# EAGLE schematic tulipv4_r11 (EAGLE 6.1)
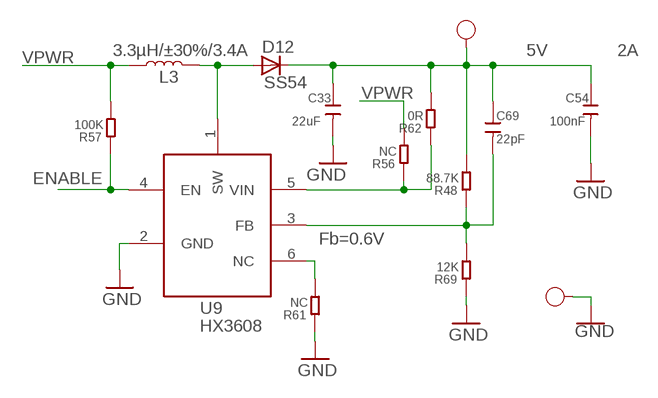
[diagram p0: schematic, sheet 1, part 1 of 2]
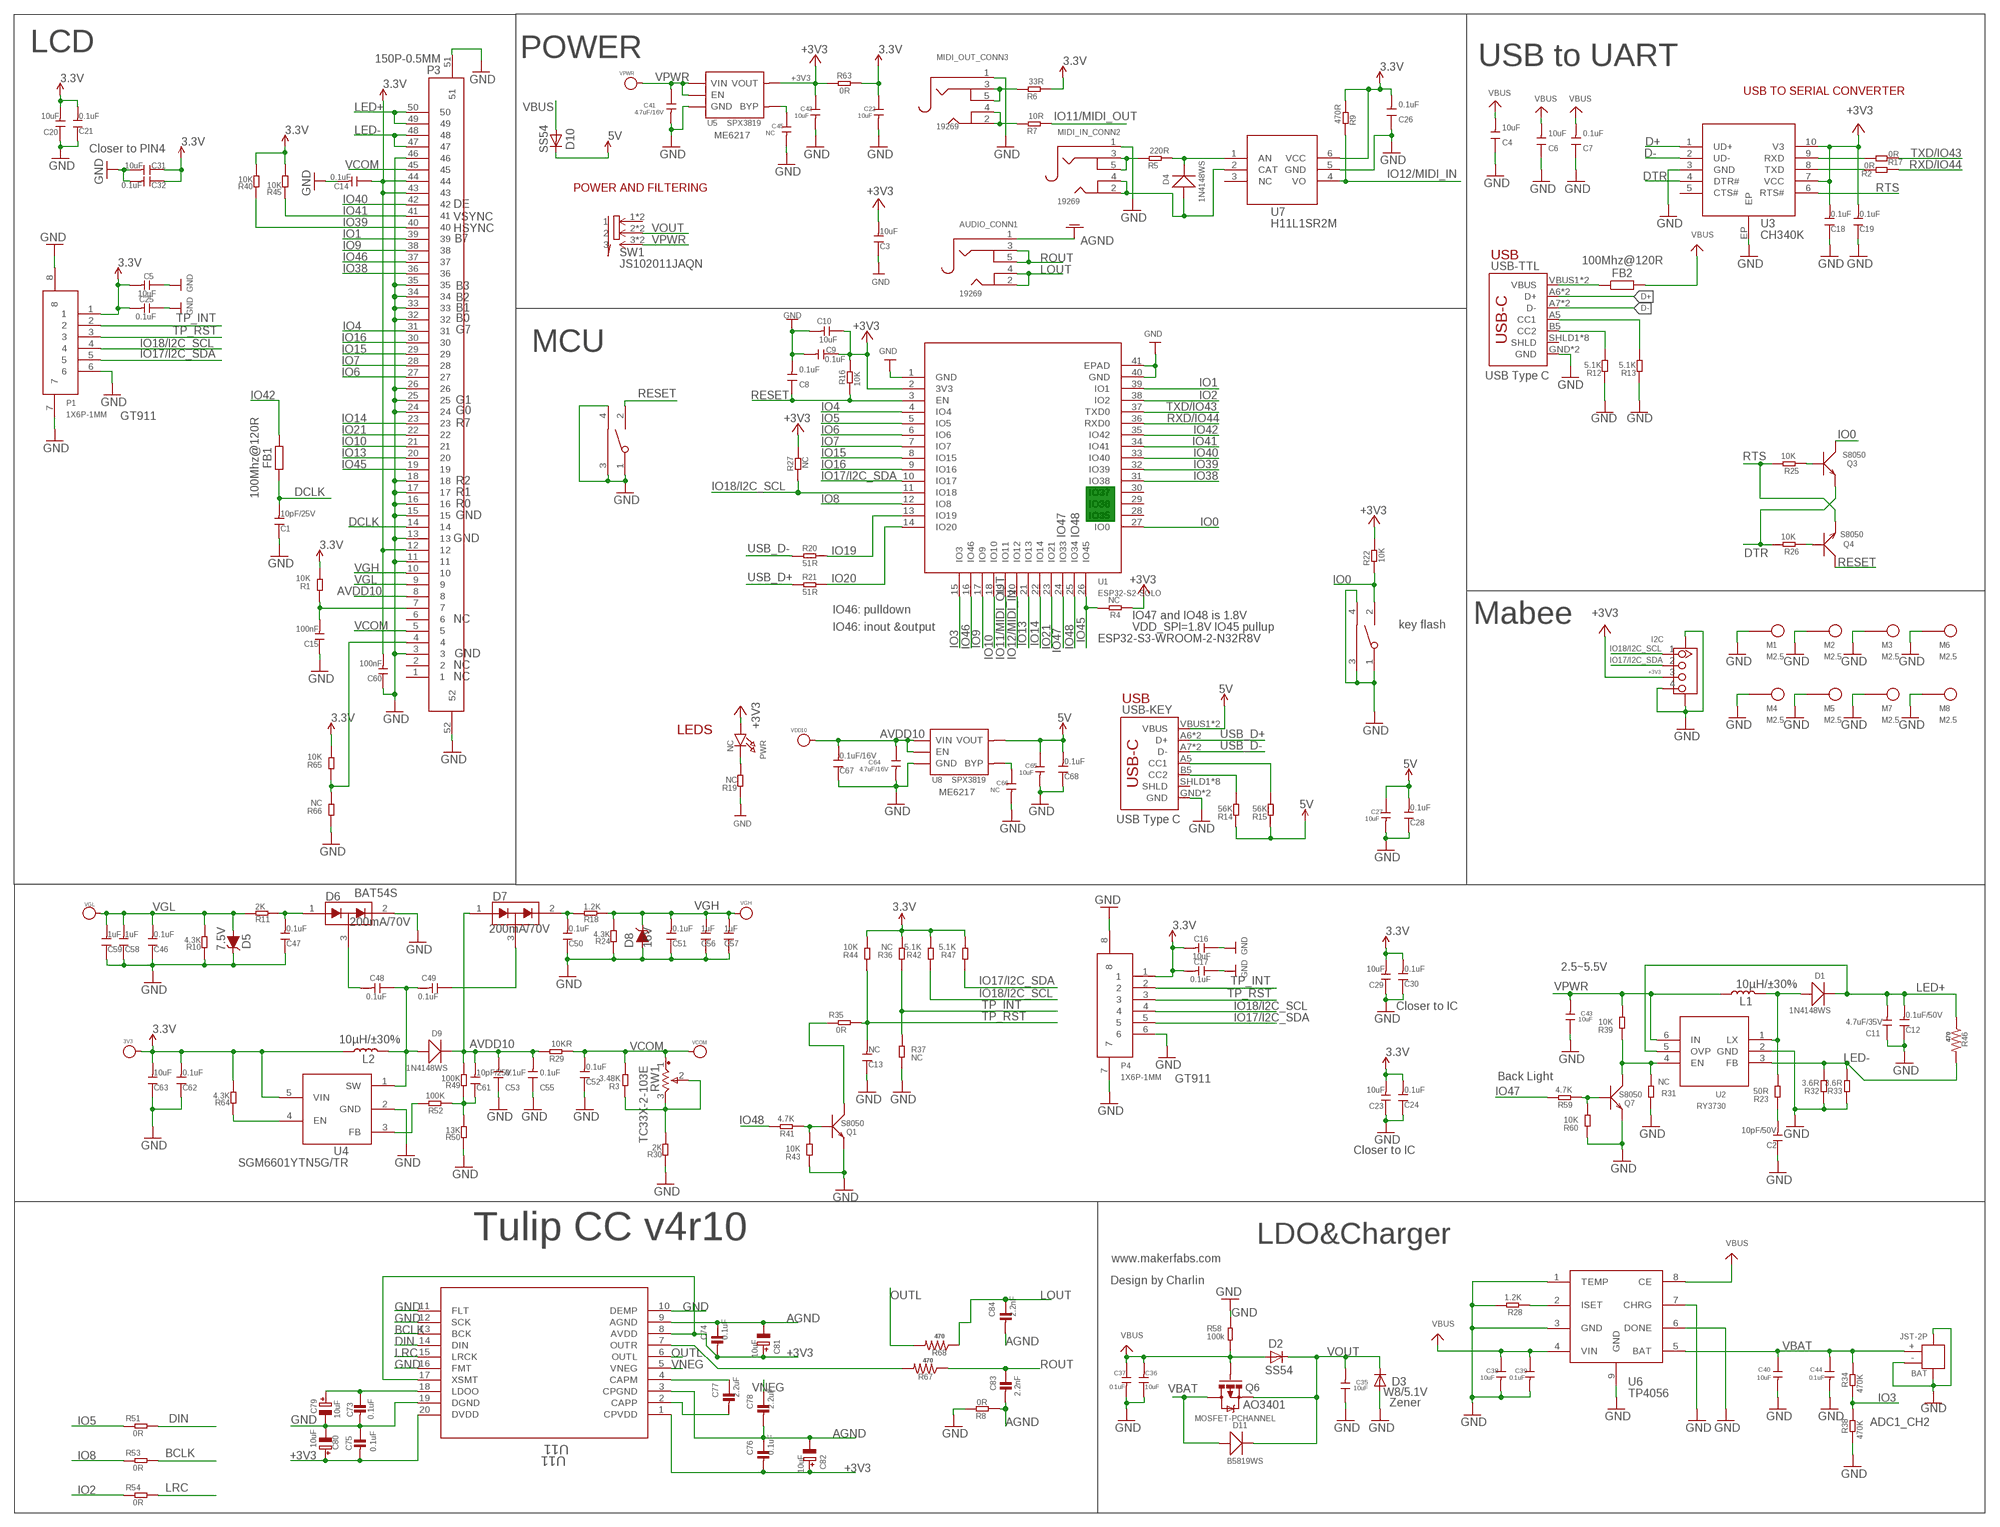
[diagram p1: schematic, sheet 1, part 2 of 2]

## Parts
3V3  PAD-TEST-POINT-CIRCLE'4545'  [TP_4545]
5V  TEST-POINT'4545'  [TP-D45MIL]
AUDIO_CONN1  19269  AUDIO_3.5MMJACK  [4UCONN_19269]
BAT  JST-2P  JST-2P-SMD'2.0'  [HW2-SMD-2.0-90D]
BOOT  TS24CA  [2*4*3.5MM]
C1  10pF/25V  DISCRETE_C-0603  [DISCRETE_C0603]
C2  10pF/50V  DISCRETE_C-0603  [DISCRETE_C0603]
C3  10uF  DISCRETE_C-0603  [DISCRETE_C0603]
C4  10uF  DISCRETE_C-0603  [DISCRETE_C0603]
C5  10uF  DISCRETE_C-0603  [DISCRETE_C0603]
C6  10uF  DISCRETE_C-0603  [DISCRETE_C0603]
C7  0.1uF  DISCRETE_C-0603  [DISCRETE_C0603]
C8  0.1uF  DISCRETE_C-0603  [DISCRETE_C0603]
C9  0.1uF  DISCRETE_C-0603  [DISCRETE_C0603]
C10  10uF  DISCRETE_C-0603  [DISCRETE_C0603]
C11  4.7uF/35V  DISCRETE_C-1206  [DISCRETE_C1206]
C12  0.1uF/50V  DISCRETE_C-0603  [DISCRETE_C0603]
C13  NC  DISCRETE_C-0603  [DISCRETE_C0603]
C14  0.1uF  DISCRETE_C-0603  [DISCRETE_C0603]
C15  100nF  DISCRETE_C-0603  [DISCRETE_C0603]
C16  10uF  DISCRETE_C-0603  [DISCRETE_C0603]
C17  0.1uF  DISCRETE_C-0603  [DISCRETE_C0603]
C18  0.1uF  DISCRETE_C-0603  [DISCRETE_C0603]
C19  0.1uF  DISCRETE_C-0603  [DISCRETE_C0603]
C20  10uF  DISCRETE_C-0603  [DISCRETE_C0603]
C21  0.1uF  DISCRETE_C-0603  [DISCRETE_C0603]
C22  10uF  C-0603  [0603]
C23  10uF  DISCRETE_C-0603  [DISCRETE_C0603]
C24  0.1uF  DISCRETE_C-0603  [DISCRETE_C0603]
C25  0.1uF  DISCRETE_C-0603  [DISCRETE_C0603]
C26  0.1uF  DISCRETE_C-0603  [DISCRETE_C0603]
C27  10uF  C-0603  [0603]
C28  0.1uF  DISCRETE_C-0603  [DISCRETE_C0603]
C29  10uF  DISCRETE_C-0603  [DISCRETE_C0603]
C30  0.1uF  DISCRETE_C-0603  [DISCRETE_C0603]
C31  10uF  DISCRETE_C-0603  [DISCRETE_C0603]
C32  0.1uF  DISCRETE_C-0603  [DISCRETE_C0603]
C33  22uF  CAP-0603  [C0603]
C35  10uF  C-0603  [0603]
C36  10uF  C-0603  [0603]
C37  0.1uF  C-0603  [0603]
C38  10uF  C-0603  [0603]
C39  0.1uF  C-0603  [0603]
C40  10uF  C-0603  [0603]
C41  4.7uF/16V  C-0603  [0603]
C42  10uF  C-0603  [0603]
C43  10uF  C-0603  [0603]
C44  0.1uF  C-0603  [0603]
C45  NC  C-0603  [0603]
C46  0.1uF  DISCRETE_C-0603  [DISCRETE_C0603]
C47  0.1uF  DISCRETE_C-0603  [DISCRETE_C0603]
C48  0.1uF  DISCRETE_C-0603  [DISCRETE_C0603]
C49  0.1uF  DISCRETE_C-0603  [DISCRETE_C0603]
C50  0.1uF  DISCRETE_C-0603  [DISCRETE_C0603]
C51  0.1uF  DISCRETE_C-0603  [DISCRETE_C0603]
C52  0.1uF  DISCRETE_C-0603  [DISCRETE_C0603]
C53  0.1uF  DISCRETE_C-0603  [DISCRETE_C0603]
C54  100nF  CAP-0603  [C0603]
C55  0.1uF  DISCRETE_C-0603  [DISCRETE_C0603]
C56  1uF  DISCRETE_C-0603  [DISCRETE_C0603]
C57  1uF  DISCRETE_C-0603  [DISCRETE_C0603]
C58  1uF  DISCRETE_C-0603  [DISCRETE_C0603]
C59  1uF  DISCRETE_C-0603  [DISCRETE_C0603]
C60  100nF  DISCRETE_C-0603  [DISCRETE_C0603]
C61  10pF/25V  DISCRETE_C-0603  [DISCRETE_C0603]
C62  0.1uF  DISCRETE_C-0603  [DISCRETE_C0603]
C63  10uF  DISCRETE_C-0603  [DISCRETE_C0603]
C64  4.7uF/16V  C-0603  [0603]
C65  10uF  C-0603  [0603]
C66  NC  C-0603  [0603]
C67  0.1uF/16V  DISCRETE_C-0603  [DISCRETE_C0603]
C68  0.1uF  DISCRETE_C-0603  [DISCRETE_C0603]
C69  22pF  CAP-0603  [C0603]
C73  0.1uF  CAP_CERAMIC0805-NOOUTLINE  [0805-NO@1]
C74  0.1uF  CAP_CERAMIC0805-NOOUTLINE  [0805-NO@1]
C75  0.1uF  CAP_CERAMIC0805-NOOUTLINE  [0805-NO@1]
C76  0.1uF  CAP_CERAMIC0805-NOOUTLINE  [0805-NO@1]
C77  2.2uF  CAP_CERAMIC0805-NOOUTLINE  [0805-NO@1]
C78  2.2uF  CAP_CERAMIC0805-NOOUTLINE  [0805-NO@1]
C79  10uF  CAP_ELECTROLYTICPANASONIC_C  [PANASONIC_C]
C80  10uF  CAP_ELECTROLYTICPANASONIC_C  [PANASONIC_C]
C81  10uF  CAP_ELECTROLYTICPANASONIC_C  [PANASONIC_C]
C82  10uF  CAP_ELECTROLYTICPANASONIC_C  [PANASONIC_C]
C83  2.2nF  CAP_CERAMIC0805-NOOUTLINE  [0805-NO@1]
C84  2.2nF  CAP_CERAMIC0805-NOOUTLINE  [0805-NO@1]
D1  1N4148WS  D'0805'  [SOD323]
D2  SS54  DIODE-DO-214AC  [DO-214AC]
D3  W8/5.1V  DIODE-SOD123  [SOD123]
D4  1N4148WS  D'0805'  [SOD323]
D5  7.5V  DIODE-ZENER-MMSZ5232BS  [SOD-323]
D6  200mA/70V  BAV99  [SOT23-3]
D7  200mA/70V  BAV99  [SOT23-3]
D8  16V  DIODE-ZENER-MMSZ5232BS  [SOD-323]
D9  1N4148WS  D'0805'  [SOD323]
D10  SS54  DIODE-DO-214AC  [DO-214AC]
D11  B5819WS  D'0805'  [SOD323]
D12  SS54  DIODE-DO-214AC  [DO-214AC]
FB1  100Mhz@120R  R-EU_R0805  [R0805]
FB2  100Mhz@120R  R-EU_R0805  [R0805]
GND  TEST-POINT'4545'  [TP-D45MIL]
I2C  GROVE-CONNECTOR-SMD'90D'  [HW4-SMD-2.0-90D]
L1  10µH/±30%  INDUCTOR-CR54-3.3UH  [CR54]
L2  10µH/±30%  INDUCTOR-CR54-3.3UH  [CR54]
L3  3.3µH/±30%/3.4A  INDUCTOR-CR54-3.3UH  [CR54]
M1  M2.5  [M2.5]
M2  M2.5  [M2.5]
M3  M2.5  [M2.5]
M4  M2.5  [M2.5]
M5  M2.5  [M2.5]
M6  M2.5  [M2.5]
M7  M2.5  [M2.5]
M8  M2.5  [M2.5]
MIDI_IN_CONN2  19269  AUDIO_3.5MMJACK  [4UCONN_19269]
MIDI_OUT_CONN3  19269  AUDIO_3.5MMJACK  [4UCONN_19269]
P1  1X6P-1MM  [1*6P-SMT1MM]
P3  150P-0.5MM  [1*50P-SMT0.5MM]
P4  1X6P-1MM  [1*6P-SMT1MM]
PWR  NC  LED0805_NOOUTLINE  [CHIPLED_0805_NOOUTLINE]
Q1  S8050  TRANSISTOR-NPN-SOT23  [SOT23]
Q3  S8050  TRANSISTOR-NPN-SOT23  [SOT23]
Q4  S8050  TRANSISTOR-NPN-SOT23  [SOT23]
Q6  MOSFET-PCHANNEL  [SOT23-3]
Q7  S8050  TRANSISTOR-NPN-SOT23  [SOT23]
R1  10K  DISCRETE_R-0603  [DISCRETE_R0603]
R2  0R  R-0603  [R0603]
R3  3.48K  DISCRETE_R-0603  [DISCRETE_R0603]
R4  NC  R-0603  [R0603]
R5  220R  R-0603  [R0603]
R6  33R  R-0603  [R0603]
R7  10R  R-0603  [R0603]
R8  0R  DISCRETE_R-0603  [DISCRETE_R0603]
R9  470R  R-0603  [R0603]
R10  4.3K  DISCRETE_R-0603  [DISCRETE_R0603]
R11  2K  DISCRETE_R-0603  [DISCRETE_R0603]
R12  5.1K  DISCRETE_R-0603  [DISCRETE_R0603]
R13  5.1K  DISCRETE_R-0603  [DISCRETE_R0603]
R14  56K  DISCRETE_R-0603  [DISCRETE_R0603]
R15  56K  DISCRETE_R-0603  [DISCRETE_R0603]
R16  10K  R-0603  [R0603]
R17  0R  R-0603  [R0603]
R18  1.2K  DISCRETE_R-0603  [DISCRETE_R0603]
R19  NC  DISCRETE_R-0603  [DISCRETE_R0603]
R20  51R  R-0603  [R0603]
R21  51R  R-0603  [R0603]
R22  10K  R-0603  [R0603]
R23  50R  DISCRETE_R-0603  [DISCRETE_R0603]
R24  4.3K  DISCRETE_R-0603  [DISCRETE_R0603]
R25  10K  R-0603  [R0603]
R26  10K  R-0603  [R0603]
R27  NC  R-0603  [R0603]
R28  1.2K  R-0603  [R0603]
R29  10KR  DISCRETE_R-0603  [DISCRETE_R0603]
R30  2K  DISCRETE_R-0603  [DISCRETE_R0603]
R31  NC  DISCRETE_R-0603  [DISCRETE_R0603]
R32  3.6R  DISCRETE_R-0603  [DISCRETE_R0603]
R33  3.6R  DISCRETE_R-0603  [DISCRETE_R0603]
R34  470K  R-0603  [R0603]
R35  0R  R-0603  [R0603]
R36  NC  DISCRETE_R-0603  [DISCRETE_R0603]
R37  NC  DISCRETE_R-0603  [DISCRETE_R0603]
R38  470K  R-0603  [R0603]
R39  10K  DISCRETE_R-0603  [DISCRETE_R0603]
R40  10K  DISCRETE_R-0603  [DISCRETE_R0603]
R41  4.7K  DISCRETE_R-0603  [DISCRETE_R0603]
R42  5.1K  DISCRETE_R-0603  [DISCRETE_R0603]
R43  10K  DISCRETE_R-0603  [DISCRETE_R0603]
R44  10K  DISCRETE_R-0603  [DISCRETE_R0603]
R45  10K  DISCRETE_R-0603  [DISCRETE_R0603]
R46  470  R-US_R0805  [R0805]
R47  5.1K  DISCRETE_R-0603  [DISCRETE_R0603]
R48  88.7K  DISCRETE_R-0603  [DISCRETE_R0603]
R49  100K  DISCRETE_R-0603  [DISCRETE_R0603]
R50  13K  DISCRETE_R-0603  [DISCRETE_R0603]
R51  0R  R-0603  [R0603]
R52  100K  DISCRETE_R-0603  [DISCRETE_R0603]
R53  0R  R-0603  [R0603]
R54  0R  R-0603  [R0603]
R56  NC  DISCRETE_R-0603  [DISCRETE_R0603]
R57  100K  DISCRETE_R-0603  [DISCRETE_R0603]
R58  100k  R-0603  [R0603]
R59  4.7K  DISCRETE_R-0603  [DISCRETE_R0603]
R60  10K  DISCRETE_R-0603  [DISCRETE_R0603]
R61  NC  DISCRETE_R-0603  [DISCRETE_R0603]
R62  0R  DISCRETE_R-0603  [DISCRETE_R0603]
R63  0R  R-0603  [R0603]
R64  4.3K  DISCRETE_R-0603  [DISCRETE_R0603]
R65  10K  DISCRETE_R-0603  [DISCRETE_R0603]
R66  NC  DISCRETE_R-0603  [DISCRETE_R0603]
R67  470  R-US_R0805  [R0805]
R68  470  R-US_R0805  [R0805]
R69  12K  DISCRETE_R-0603  [DISCRETE_R0603]
RST  TS24CA  [2*4*3.5MM]
RW1  TC33X-2-103E  [TC33-3MM-SMD]
SW1  JS102011JAQN  [SMD-6-2.5MM]
U1  ESP32­S2­SOLO  [ESP32-­S2-­SOLO]
U2  RY3730  [SOT23-6]
U3  CH340K  [ESOP-10-EP-150MIL]
U4  SGM6601YTN5G/TR  [SOT-23-5]
U5  SPX3819  [SOT23-5]
U6  TP4056  [SOP8-1.27P]
U7  H11L1SR2M  [SOP-6-2.54MM]
U8  SPX3819  [SOT23-5]
U9  HX3608  [SOT-23-6]
U11  U11  PCM5101APW  [PW20_TEX]
USB-KEY  USB_C5  [USB-C-16P-5]
USB-TTL  USB_C5  [USB-C-16P-5]
VCOM  PAD-TEST-POINT-CIRCLE'4545'  [TP_4545]
VDD10  PAD-TEST-POINT-CIRCLE'4545'  [TP_4545]
VGH  PAD-TEST-POINT-CIRCLE'4545'  [TP_4545]
VGL  PAD-TEST-POINT-CIRCLE'4545'  [TP_4545]
VPWR  PAD-TEST-POINT-CIRCLE'4545'  [TP_4545]

## Nets
3.3V: 3V3.T C5.2 C14.1 C16.2 C17.2 C20.2 C21.2 C22.1 C23.2 C24.2 C25.2 C26.2 C29.2 C30.2 C31.1 C32.1 C60.2 C62.2 C63.2 L2.P$1 P1.1 P3.12 P3.43 P3.44 P4.1 R1.2 R6.1 R9.1 R36.2 R40.2 R42.2 R44.2 R45.2 R47.2 R63.2 R64.2 R65.2 U4.5(VIN) U7.6(VCC)
5V: 5V.T C27.1 C28.2 C33.1 C54.1 C65.1 C68.2 C69.1 D10.C D12.C R14.1 R15.1 R48.2 R62.2 U8.5(VOUT) USB-KEY.VBUS1(VBUS) USB-KEY.VBUS2(VBUS)
+3V3: C3.2 C9.1 C10.1 C18.2 C19.2 C42.1 C74.2 C75.2 C76.2 C80.+ C81.+ C82.+ I2C.3 PWR.A R4.1 R16.2 R22.2 R27.2 R63.1 U1.2(3V3) U3.7(VCC) U3.10(V3) U5.5(VOUT) U11.1(CPVDD) U11.8(AVDD) U11.17(XSMT) U11.20(DVDD)
AGND: AUDIO_CONN1.1 C74.1 C76.1 C78.2 C81.- C82.- C83.2 C84.2 R8.1 U11.3(CPGND) U11.9(AGND)
AVDD10: C53.2 C55.2 C61.2 C64.1 C67.2 D7.1(A1) D9.- P3.8 R29.2 R49.2 U8.1(VIN) U8.3(EN) VDD10.T
BCLK: R53.2 U11.13(BCK)
D+: U3.1(UD+) USB-TTL.A6(D+) USB-TTL.B6(D+)
D-: U3.2(UD-) USB-TTL.A7(D-) USB-TTL.B7(D-)
DCLK: C1.2 FB1.1 P3.14
DIN: R51.2 U11.14(DIN)
DTR: Q3.2(E) R26.2 U3.4(DTR#)
ENABLE: R57.1 U9.4(EN)
GND: BAT.3 BAT.4 BAT.- BOOT.1 BOOT.3 BOOT.4 C1.1 C2.1 C3.1 C4.1 C5.1 C6.1 C7.1 C8.2 C9.2 C10.2 C11.1 C12.1 C13.1 C14.2 C15.1 C16.1 C17.1 C18.1 C19.1 C20.1 C21.1 C22.2 C23.1 C24.1 C25.1 C26.1 C27.2 C28.1 C29.1 C30.1 C31.2 C32.2 C33.2 C35.1 C36.1 C37.2 C38.2 C39.2 C40.2 C41.2 C42.2 C43.1 C44.2 C45.2 C46.1 C47.1 C50.1 C51.1 C52.1 C53.1 C54.2 C55.1 C56.1 C57.1 C58.1 C59.1 C60.1 C62.1 C63.1 C64.2 C65.2 C66.2 C67.1 C68.1 C73.2 C75.1 C79.- C80.- D3.A D5.C D6.2(C2) D8.A GND.T I2C.4 I2C.SS1 I2C.SS2 M1.1 M2.1 M3.1 M4.1 M5.1 M6.1 M7.1 M8.1 MIDI_IN_CONN2.1 MIDI_OUT_CONN3.1 P1.6 P1.7 P1.8 P3.3 P3.11 P3.13 P3.15 P3.16 P3.17 P3.18 P3.24 P3.25 P3.26 P3.32 P3.33 P3.34 P3.35 P3.46 P3.51 P3.52 P4.6 P4.7 P4.8 Q1.2(E) Q7.2(E) R8.2 R10.1 R12.1 R13.1 R19.1 R24.1 R28.2 R30.1 R31.1 R32.1 R33.1 R37.2 R38.1 R43.1 R50.1 R58.2 R60.1 R61.1 R66.1 R69.1 RST.1 RST.3 RST.4 U1.1(GND) U1.40(GND) U1.41(EPAD) U2.2(GND) U3.3(GND) U3.EP U4.2(GND) U5.2(GND) U6.1(TEMP) U6.3(GND) U6.6(DONE) U6.7(CHRG) U6.9(GND) U7.5(GND) U8.2(GND) U9.2(GND) U11.10(DEMP) U11.11(FLT) U11.12(SCK) U11.16(FMT) U11.19(DGND) USB-KEY.GND USB-KEY.GND2(GND) USB-TTL.GND USB-TTL.GND2(GND)
IO0: BOOT.2 Q3.3(C) R22.1 U1.27(IO0)
IO1: P3.39 U1.39(IO1)
IO2: R54.1 U1.38(IO2)
IO3: R34.1 R38.2 U1.15(IO3)
IO4: P3.31 U1.4(IO4)
IO5: R51.1 U1.5(IO5)
IO6: P3.27 U1.6(IO6)
IO7: P3.28 U1.7(IO7)
IO8: R53.1 U1.12(IO8)
IO9: P3.38 U1.17(IO9)
IO10: P3.21 U1.18(IO10)
IO11/MIDI_OUT: R7.1 U1.19(IO11)
IO12/MIDI_IN: R9.2 U1.20(IO12) U7.4(VO)
IO13: P3.20 U1.21(IO13)
IO14: P3.23 U1.22(IO14)
IO15: P3.29 U1.8(IO15)
IO16: P3.30 U1.9(IO16)
IO17/I2C_SDA: I2C.2 P1.5 P4.5 R47.1 U1.10(IO17)
IO18/I2C_SCL: I2C.1 P1.4 P4.4 R27.1 R42.1 U1.11(IO18)
IO19: R20.2 U1.13(IO19)
IO20: R21.2 U1.14(IO20)
IO21: P3.22 U1.23(IO21)
IO38: P3.36 U1.31(IO38)
IO39: P3.40 R40.1 U1.32(IO39)
IO40: P3.42 U1.33(IO40)
IO41: P3.41 R45.1 U1.34(IO41)
IO42: FB1.2 U1.35(IO42)
IO45: P3.19 R4.2 U1.26(IO45)
IO46: P3.37 U1.16(IO46)
IO47: R59.2 U1.24(IO33)
IO48: R41.2 U1.25(IO34)
LCD_RST: C15.2 P3.7 R1.1
LED+: C11.2 C12.2 D1.- P3.49 P3.50 R46.1 U2.5(OVP)
LED-: P3.47 P3.48 R32.2 R33.2 R46.2 U2.3(FB)
LOUT: AUDIO_CONN1.2 AUDIO_CONN1.4 C84.1 R68.1
LRC: R54.2 U11.15(LRCK)
N$1: C47.2 D6.1(A1) R11.1
N$2: Q4.1(B) R26.1
N$3: Q3.1(B) R25.1
N$4: C61.1 R49.1 R50.2 R52.1
N$5: P3.4 R65.1 R66.2
N$6: R15.2 USB-KEY.A5(CC1)
N$7: PWR.C R19.2
N$8: C48.2 D6.3(COM)
N$9: C48.1 C49.2 D9.+ L2.P$2 U4.1(SW)
N$10: R13.2 USB-TTL.A5(CC1)
N$11: R12.2 USB-TTL.B5(CC2)
N$12: C49.1 D7.3(COM)
N$13: C50.2 D7.2(C2) R18.2
N$14: R14.2 USB-KEY.B5(CC2)
N$15: R52.2 U4.3(FB)
N$16: R3.1 R30.2 RW1.2 RW1.3
N$17: D1.+ L1.P$2 R23.2 U2.1(LX)
N$18: Q1.3(C) R35.1
N$19: R64.1 U4.4(EN)
N$20: Q1.1(B) R41.1 R43.2
N$21: FB2.1 USB-TTL.VBUS1(VBUS) USB-TTL.VBUS2(VBUS)
N$22: C2.2 R23.1
N$23: MIDI_IN_CONN2.3 MIDI_IN_CONN2.5 R5.2
N$24: Q7.3(C) R31.2 R39.1 U2.4(EN)
N$25: D12.A L3.P$2 U9.1(SW)
N$26: D4.- R5.1 U7.1(AN)
N$27: MIDI_OUT_CONN3.3 MIDI_OUT_CONN3.5 R6.2
N$28: C69.2 R48.1 R69.2 U9.3(FB)
N$29: Q7.1(B) R59.1 R60.2
N$30: R28.1 U6.2(ISET)
N$31: R61.2 U9.6(NC)
N$32: R56.1 R62.1 U9.5(VIN)
N$33: C66.1 U8.4(BYP)
N$35: MIDI_OUT_CONN3.2 MIDI_OUT_CONN3.4 R7.2
N$36: D4.+ MIDI_IN_CONN2.2 MIDI_IN_CONN2.4 U7.2(CAT)
N$43: C73.1 C79.+ U11.18(LDOO)
N$44: R67.2 U11.7(OUTR)
N$45: C77.1 U11.4(CAPM)
N$46: R17.2 U3.9(RXD)
N$47: C77.2 U11.2(CAPP)
N$49: R2.2 U3.8(TXD)
N$76: C45.1 U5.4(BYP)
OUTL: R68.2 U11.6(OUTL)
RESET: C8.1 Q4.3(C) R16.1 RST.2 U1.3(EN)
ROUT: AUDIO_CONN1.3 AUDIO_CONN1.5 C83.1 R67.1
RTS: Q4.2(E) R25.2 U3.6(RTS#)
RXD/IO44: R2.1 U1.36(RXD0)
TP_INT: P1.2 P4.2 R36.1 R37.1
TP_RST: C13.2 P1.3 P4.3 R35.2 R44.1
TXD/IO43: R17.1 U1.37(TXD0)
USB_D+: R21.1 USB-KEY.A6(D+) USB-KEY.B6(D+)
USB_D-: R20.1 USB-KEY.A7(D-) USB-KEY.B7(D-)
VBAT: BAT.+ C40.1 C44.1 D11.+ Q6.3(D) R34.2 U6.5(BAT)
VBUS: C4.2 C6.2 C7.2 C36.2 C37.1 C38.1 C39.1 D2.A D10.A FB2.2 Q6.1(G) R58.1 U6.4(VIN) U6.8(CE)
VCOM: C52.2 P3.5 P3.45 R3.2 R29.1 RW1.1 VCOM.T
VGH: C51.2 C56.2 C57.2 D8.C P3.10 R18.1 R24.2 VGH.T
VGL: C46.2 C58.2 C59.2 D5.A P3.9 R10.2 R11.2 VGL.T
VNEG: C78.1 U11.5(VNEG)
VOUT: C35.2 D2.C D3.C D11.- Q6.2(S) SW1.2 SW1.2@1
VPWR: C41.1 C43.2 L1.P$1 L3.P$1 R39.2 R56.2 R57.2 SW1.3 SW1.3@1 U2.6(IN) U5.1(VIN) U5.3(EN) VPWR.T
Unconnected: P3.1 P3.2 P3.6 SW1.1 SW1.1@1 U1.28(IO35) U1.29(IO36) U1.30(IO37) U3.5(CTS#) U7.3(NC) USB-KEY.SHLD1(SHLD) USB-KEY.SHLD2(SHLD) USB-KEY.SHLD3(SHLD) USB-KEY.SHLD4(SHLD) USB-KEY.SHLD5(SHLD) USB-KEY.SHLD6(SHLD) USB-KEY.SHLD7(SHLD) USB-KEY.SHLD8(SHLD) USB-TTL.SHLD1(SHLD) USB-TTL.SHLD2(SHLD) USB-TTL.SHLD3(SHLD) USB-TTL.SHLD4(SHLD) USB-TTL.SHLD5(SHLD) USB-TTL.SHLD6(SHLD) USB-TTL.SHLD7(SHLD) USB-TTL.SHLD8(SHLD)

## Notes on the sheet
- LCD | POWER
- USB to UART
- USB TO SERIAL CONVERTER
- ME6217
- Closer to PIN4
- POWER AND FILTERING
- DE
- VSYNC
- HSYNC
- B7
- USB
- B3
- B2
- B1
- B0
- G7
- MCU
- USB Type C
- G1
- G0
- GT911
- R7
- R2
- R1
- R0
- GND
- IO47 | IO48
- GND
- IO46: pulldown
- IO47 and IO48 is 1.8V
- NC | Mabee
- IO46: inout &output | VDD_SPI=1.8V IO45 pullup | key flash
- ESP32-S3-WROOM-2-N32R8V
- GND
- NC
- NC
- USB
- LEDS
- ME6217
- USB Type C
- BAT54S
- 2A
- 2.5~5.5V
- Closer to IC
- Fb=0.6V
- GT911 | Back Light
- Closer to IC
- Tulip CC v4r10 | LDO&Charger
- www.makerfabs.com
- Design by Charlin
- AO3401 | Zener
- ADC1_CH2

## Library data of the parts
3V3 VCOM VDD10 VGH VGL VPWR = Discrete:PAD-TEST-POINT-CIRCLE; PARTNO: DNP
5V GND = Discrete-new:TEST-POINT; PARTNO: DNP
AUDIO_CONN1 MIDI_IN_CONN2 MIDI_OUT_CONN3 = microbuilder:AUDIO_3.5MMJACK: 3.5MM Audio Jack These are normally connected as follows, from left-to right on the schematic symbol above: Tip: Left Audio Inner Ring: Right Audio Shell: Common/GND
BAT = Connector-new:JST-2P-SMD: 2P-SMD-1.0-90D:320110054;2P-SMD-2.0-90D:320110026
BOOT RST = sale:TS24CA
C1-C21 C23-C26 C28-C32 C46-C53 C55-C63 C67 C68 = A9G:DISCRETE_C*: Ceramic Capacitors
C22 C27 C35-C45 C64-C66 = Discrete:C*: Ceramic Capacitors
C33 C54 C69 = Discrete-new:CAP: Ceramic Capacitors
C73-C78 C83 C84 = microbuilder:CAP_CERAMIC: Ceramic Capacitors For new designs, use the packages preceded by an '_' character since they are more reliable: The following footprints should be used on most boards: _0402 - Standard footprint for regular board layouts _0603 - Standard footprint for regular board layouts _0805 - Standard footprint for regular board layouts _1206 - Standard footprint for regular board layouts For extremely tight-pitch boards where space is at a premium, the following 'micro-pitch' footprints can be used (smaller pads, no silkscreen outline, etc.): _0402MP - Micro-pitch footprint for very dense/compact boards _0603MP - Micro-pitch footprint for very dense/compact boards _0805MP - Micro-pitch footprint for very dense/compact boards _1206MP - Micro-pitch footprint for very dense/compact boards
C79-C82 = microbuilder:CAP_ELECTROLYTIC: Electrolytic Capacitors SMT PANASONIC_C - Size C Panasonic Electrolytic Aluminum Capacitor 47µF 16V 20% Electrolytic Capacitor [Digikey: PCE3890TR-ND] PANASONIC_D - Size D Panasonic Electrolytic Aluminum Capacitor 100µF 25V 20% Electrolytic Capacitor [Digikey: PCE3898TR-ND] PTH 3.5 mm grid, 8 mm diameter ... 3.5 mm grid, 10 mm diameter ...
D1 D4 D9 D11 = Discrete:D*
D2 D3 D10 D12 = diode:DIODE-: DIODE
D5 D8 = SparkFun-DiscreteSemi:DIODE-ZENER: Zener Diode A Zener diode allows current to flow from its anode to its cathode like a normal semiconductor diode, but it also permits current to flow in the reverse direction when its "Zener voltage" is reached. - WIkipedia; PROD_ID: DIO-12442; VALUE: 5.6V
D6 D7 = SparkFun-DiscreteSemi:BAV99: Series-pair diode array Two small signal silicon diodes connected anode to cathode. Connections to all three nodes available. Link to datasheet <https://www.fairchildsemi.com/datasheets/BA/BAV99.pdf> SparkFun Products: SparkFun AutoDriver <https://www.sparkfun.com/products/13752>; PROD_ID: DIO-10647
FB1 FB2 = rcl:R-EU_: RESISTOR, European symbol
I2C = Connector-new:GROVE-CONNECTOR-SMD: 4P-SMD-2.0:320110030;4P-SMD-2.0-90D:320110032
L1 L2 = SparkFun-Coils:INDUCTOR: Inductors Resist changes in electrical current. Basically a coil of wire. SparkFun Products: SparkFun Load Cell Amplifier - HX711 <https://www.sparkfun.com/products/13879> IOIO-OTG - V2.2 <https://www.sparkfun.com/products/13613>; PROD_ID: NDUC-11157; VALUE: 3.3µH/±30%/3.4A
L3 = SparkFun-Coils:INDUCTOR: Inductors Resist changes in electrical current. Basically a coil of wire. SparkFun Products: SparkFun Load Cell Amplifier - HX711 <https://www.sparkfun.com/products/13879> IOIO-OTG - V2.2 <https://www.sparkfun.com/products/13613>; PROD_ID: NDUC-11157
M1-M8 = sale:M2.5
P1 P4 = sale:1X6P-1MM
P3 = sale:1*50P-0.5MM
PWR = microbuilder:LED: LED 0603 - 0603 Surface Mount Package 2mA: Green LED - Low Power (3.9mcd, 2ma, 1.7Vf) - Digikey: 475-2709-2-ND Orange LED - Low Power (9.8mcd, 2ma, 1.8Vf) - Digikey: 475-1194-2-ND Red LED - Low Power (5mcd, 2ma, 1.8Vf) - Digikey: 475-1195-2-ND Yellow LED - Low Power (7mcd, 2ma, 1.8Vf) - Digikey: 475-1196-2-ND 5mA: Blue LED - Low Power (17mcd, 5ma, 2.9Vf) - Digikey: LNJ937W8CRACT-ND 0805 - 0805 Surface Mount Package 2mA: Red LED (8.8mcd, 2mA, 1.8Vf, Clear) - Low Power [Digikey: 475-2510-1-ND] Green LED (5mcd, 2mA, 1.8Vf, Clear) - Low Power [Digikey: 475-2730-1-ND] Yellow LED (11.3mcd, 2mA, 1.8Vf, Clear) - Low Power [Digikey: 475-2555-1-ND] 20mA: Red LED (104mcd, 20mA, Diffused) - LS R976 [Digikey: 475-1278-6-ND] Red LED (12mcd, 20mA, 2.0Vf, Clear) - APT2012EC [Digikey: 754-1128-1-ND] Green LED (15mcd, 20mA, 2.2Vf, Clear) - APT2012GC [Digikey: 754-1131-1-ND] Orange LED (160mcd, 20mA, 2.1Vf, Clear) - APT2012SECK [Digikey: 754-1130-1-ND] 1206 - 1206 Surface Mount Package Green LED (26mcd, 20mA, Diffused) - LG N971 [Digikey: 475-1407-6-ND] Red LED (15mcd, 20mA, Diffused) - LH N974 [Digikey: 475-1416-6-ND] Cree - Cree High-Power Surface Mount LEDs XPEBWT-L1-0000-00D50 - White 111lm 350mA 2.9Vf 6200K 110° XTEAWT-00-0000-00000LEE3 - White 114lm 350mA 2.85Vf 5000K 115° Everlight - Everlight 45-21 Series Surface Mount LEDs 45-21/QK2C-B2832AC2CB2/2T - Warm White 2000mcd 20mA 3.25Vf 3050K 120° 45-21/LK2C-B38452C4CB2/2T - Nuetral White 2000mcd 20mA 3.25Vf 4150K 120° 45-21/LK2C-B50634C6CB2/2T - Cold White 2200mcd 20mA 3.25Vf 5650K 120° PLCC2 Reverse Mount LS T77K-J1L2-1-0-2-R18-Z - Red 11.25mcd 2mA 1.8Vf 630nm 120° LO T77K-L1M2-24-Z - Orange 19.6mcd 2mA 1.8Vf 606nm 120° LY T77K-K2M1-26-Z - Yellow 15.7mcd 2mA 1.8Vf 587nm 120°
Q1 Q3 Q4 Q7 = Discrete:TRANSISTOR-NPN*: NPN audion
Q6 = User-Submitted:MOSFET-PCHANNEL: Generic PMOSFET IRLML2244 - TRANS-11153 (SOT-23 -20V -4.3A) (1.Gate 2.Source 3.Drain) FQP27P06 - COM-10349 <http://www.sparkfun.com/products/10349> (TO-220 -60V -27A) (1.Gate 2.Source 3.Drain); PROD_ID: TRANS-08285
R1 R3 R8 R10-R15 R18 R19 R23 R24 R29-R33 R36 R37 R39-R45 R47-R50 R52 R56 R57 R59-R62 R64-R66 R69 = A9G:DISCRETE_R*
R2 R4-R7 R9 R16 R17 R20-R22 R25-R28 R34 R35 R38 R51 R53 R54 R58 R63 = Discrete:R*
R46 R67 R68 = adafruit:R-US_: RESISTOR, American symbol
RW1 = sale:TC33X-2-103E
SW1 = sale:JS102011JAQN
U1 = self:ESP32­S2­SOLO
U2 = sale:RY3730
U3 = sale:CH340K
U4 = sale:SGM6601YTN5G/TR
U5 U8 = IC:SPX3819
U6 = self:TP4056
U7 = sale:H11L1SR2M
U9 = self:HX3608
U11 = pcm5101apw:PCM5101APW; COPYRIGHT: Copyright (C) 2022 Ultra Librarian. All rights reserved.; DIGI-KEY_PART_NUMBER_1: PCM5101APW-ND; MANUFACTURER_PART_NUMBER: PCM5101APW; MFR_NAME: Texas Instruments
USB-KEY USB-TTL = USBC:USB_C: USB Type C 16Pin Connector Super Speed pins not available on the 16-pin purely SMD connector so this part is best for USB 2.0 implementations. D1 and D2 are tied together enabling D+/- no matter which way the cable is plugged into the connector. The two channel configuration pins (CC1/2) are exposed. These are normally connected to ground via 5.1k resistors but can be reconfigured for high current/high power applications.

## Net classes
0 default: width 0.203 mm, drill 0.305 mm, clearance 0.152 mm
1 vbat: width 0.254 mm, drill 0.305 mm, clearance 0.152 mm